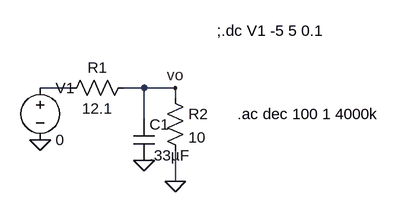
[diagram p0: schematic Draft1.asc]
Draft1.asc, the LTspice schematic file:
Version 4
SHEET 1 916 680
WIRE 416 272 368 272
WIRE 528 272 496 272
WIRE 576 272 528 272
WIRE 576 288 576 272
WIRE 528 320 528 272
WIRE 576 416 576 368
FLAG 576 272 vo
FLAG 368 352 0
FLAG 528 384 0
FLAG 576 416 0
SYMBOL res 512 256 R90
WINDOW 0 0 56 VBottom 2
WINDOW 3 32 56 VTop 2
SYMATTR InstName R1
SYMATTR Value 12.1
SYMBOL cap 512 320 R0
SYMATTR InstName C1
SYMATTR Value .33µF
SYMBOL voltage 368 256 R0
SYMATTR InstName V1
SYMATTR Value 0
SYMATTR Value2 AC 1
SYMBOL Res 560 272 R0
SYMATTR InstName R2
SYMATTR Value 10
TEXT 640 184 Left 2 !;.dc V1 -5 5 0.1
TEXT 672 312 Left 2 !.ac dec 100 1 4000k

The netlist it stands for:
* Draft1.asc
R1 vo N001 12.1
C1 vo 0 .33µF
V1 N001 0 0 AC 1
R2 vo 0 10
;.dc V1 -5 5 0.1
.ac dec 100 1 4000k
.backanno
.end